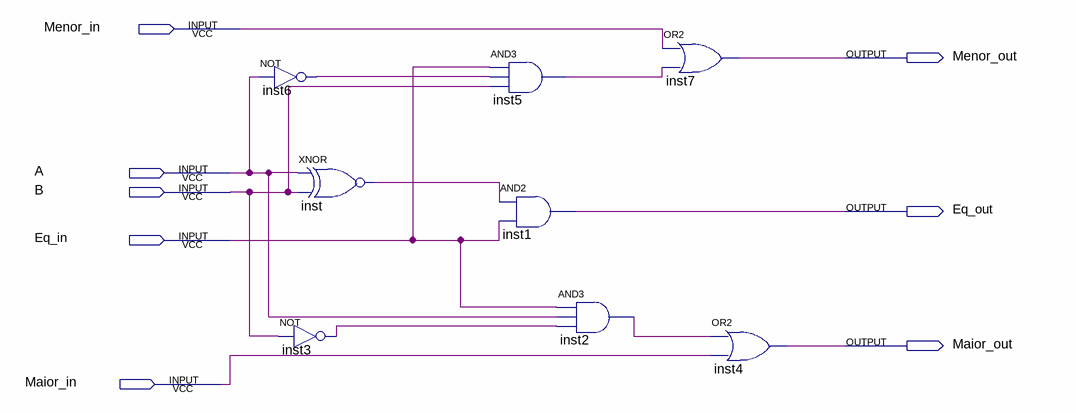
[diagram p0: schematic sheet]
// Quartus schematic comp_1bit.bdf as structural Verilog: 8 symbols, 8 pins
module comp_1bit (
  input  Menor_in,
  input  A,
  input  B,
  input  Eq_in,
  input  Maior_in,
  output Menor_out,
  output Eq_out,
  output Maior_out
);

  wire inst2_out, inst3_out, inst5_out, inst6_out, inst_out;

  not inst6 (inst6_out, A);
  not inst3 (inst3_out, B);
  xnor inst (inst_out, A, B);
  and inst5 (inst5_out, Eq_in, inst6_out, B);
  and inst1 (Eq_out, inst_out, Eq_in);
  and inst2 (inst2_out, Eq_in, A, inst3_out);
  or inst7 (Menor_out, Menor_in, inst5_out);
  or inst4 (Maior_out, inst2_out, Maior_in);
endmodule
